# Altium project PCB_Project.PrjPcb
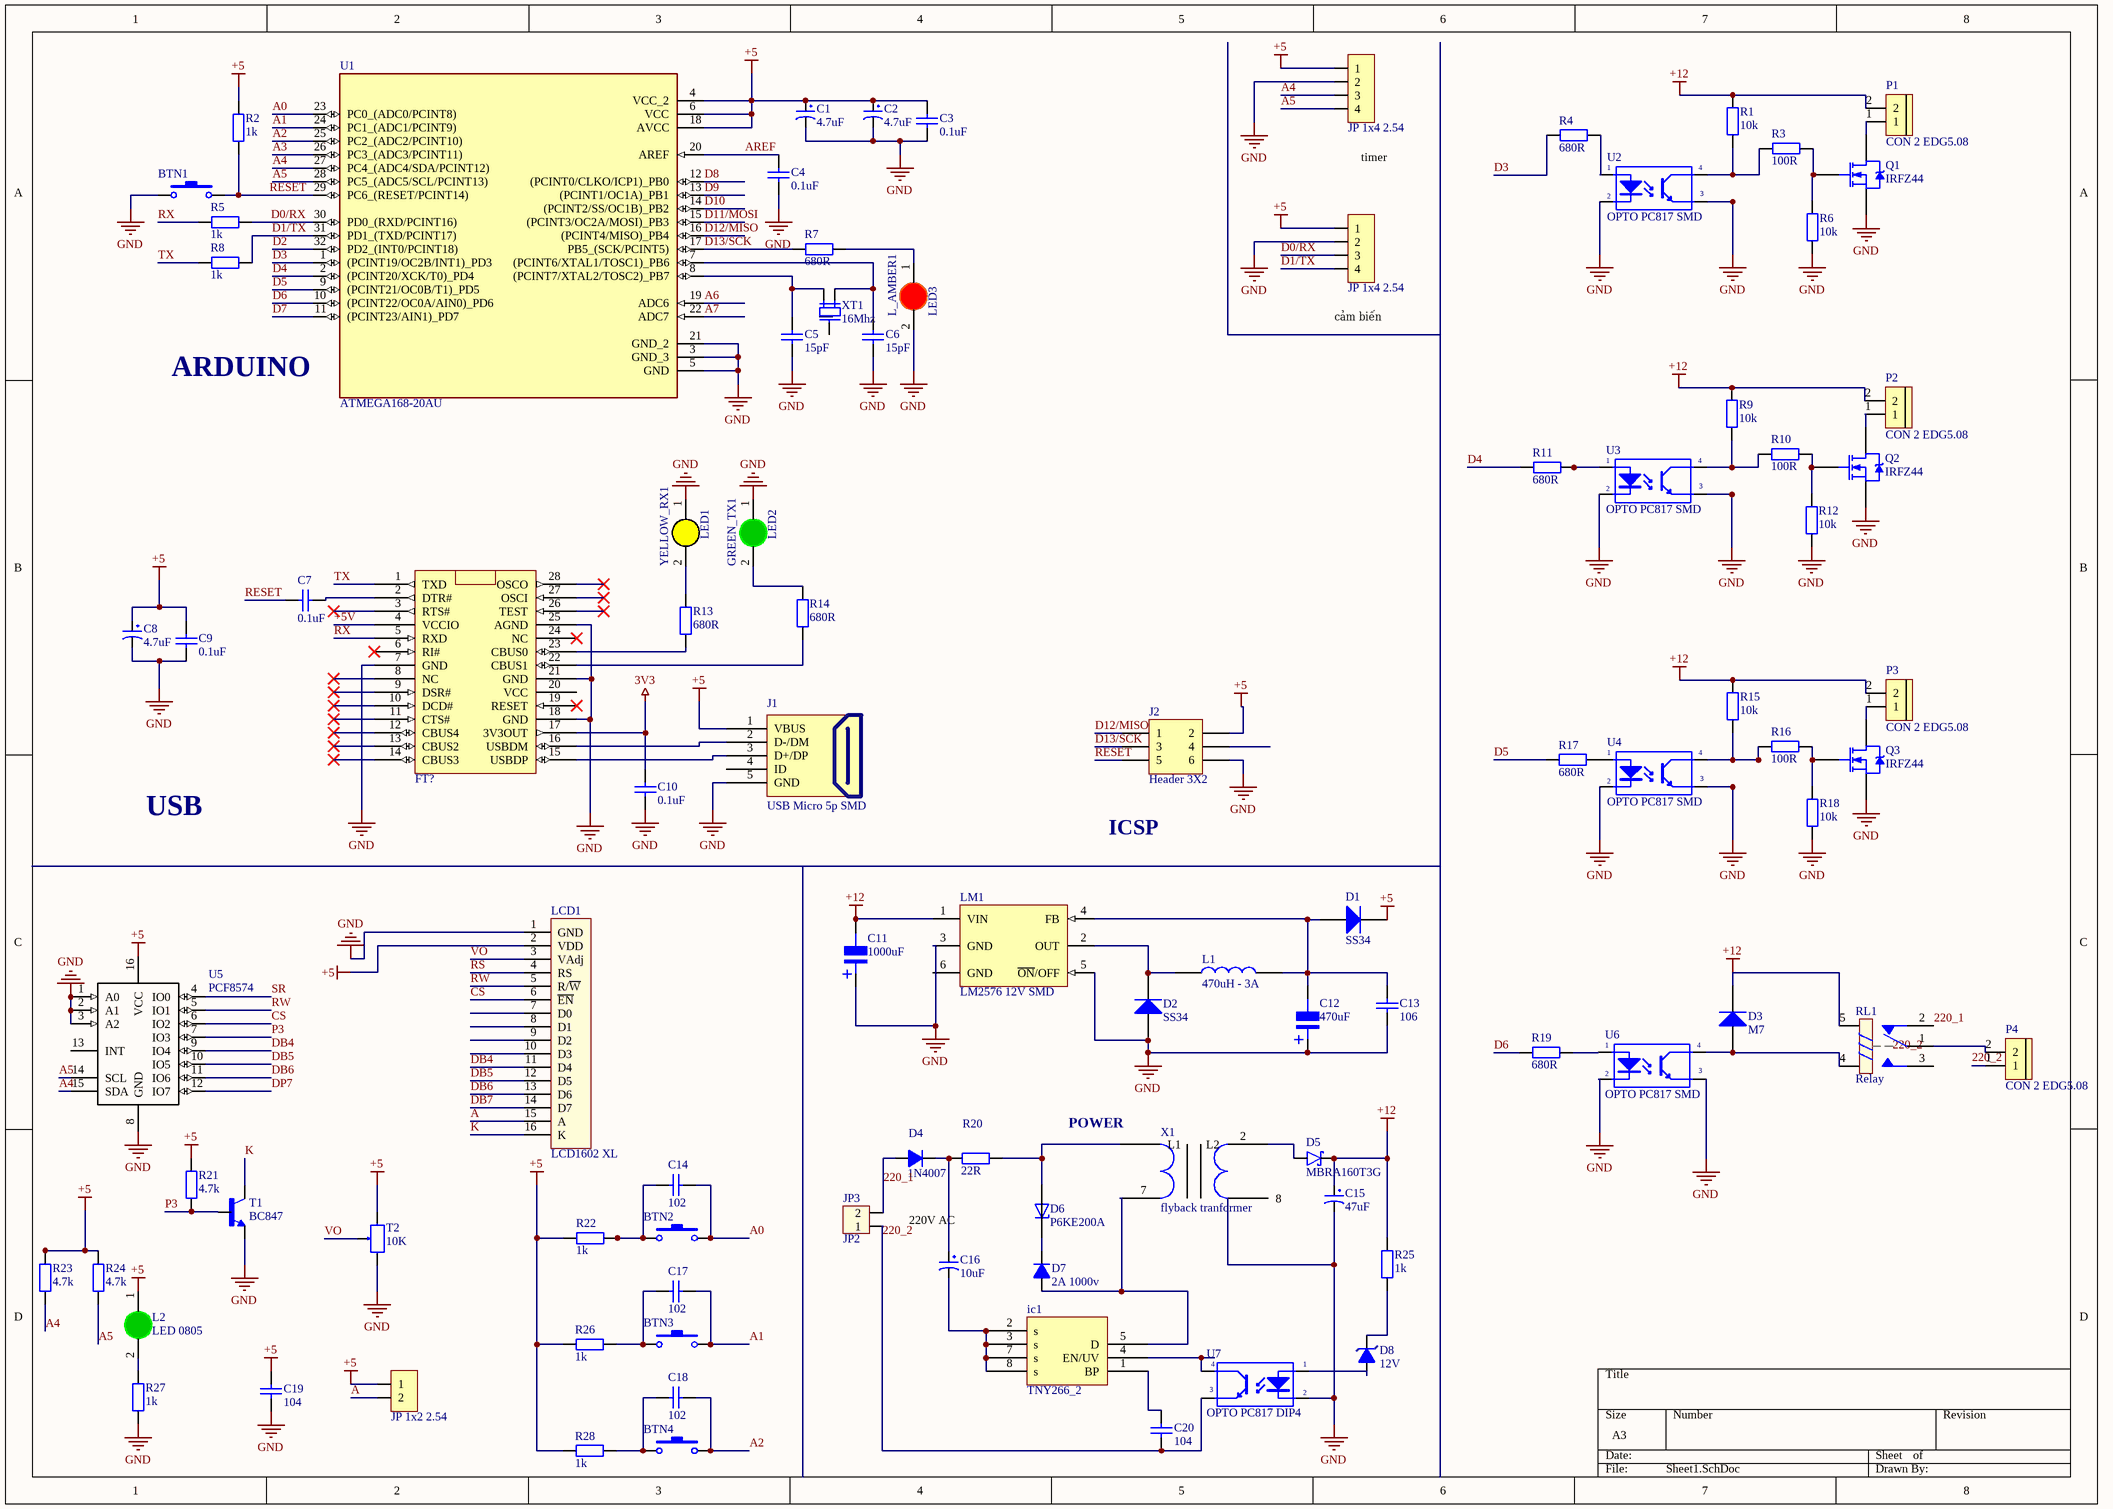
[diagram p0: Sheet1.SchDoc]
1 sheet, 94 parts. Net scope: global (net labels, ports and power ports of the same name join across sheets).
Board file: PCB1.PcbDoc

## Sheet Sheet1.SchDoc
size A3; SheetNumber: 1; SheetTotal: 1

### Parts
BTN1  Nut Nhan 2 Chan SMD 3x6x2.5  [Nut Nhan 2 Chan SMD 3x6x2.5]  (value not drawn)
BTN2  Nut Nhan 2 Chan SMD 3x6x2.5  [Nut Nhan 2 Chan SMD 3x6x2.5]  (value not drawn)
BTN3  Nut Nhan 2 Chan SMD 3x6x2.5  [Nut Nhan 2 Chan SMD 3x6x2.5]  (value not drawn)
BTN4  Nut Nhan 2 Chan SMD 3x6x2.5  [Nut Nhan 2 Chan SMD 3x6x2.5]  (value not drawn)
C1  4.7uF  [tu tantalum smd3216]
C2  4.7uF  [tu tantalum smd3216]
C3  0.1uF  [tu 0805]
C4  0.1uF  [tu 0805]
C5  15pF  [tu 0805]
C6  15pF  [tu 0805]
C7  0.1uF  [tu 0805]
C8  4.7uF  [tu tantalum smd3216]
C9  0.1uF  [tu 0805]
C10  0.1uF  [tu 0805]
C11  1000uF  [tu nhom 10 (G)]
C12  470uF  [tu nhom 10 (G)]
C13  106  [tu gom]
C14  102  [tu 0805]
C15  47uF  [tu hoa 5mm]
C16  10uF  [tu hoa 13mm]
C17  102  [tu 0805]
C18  102  [tu 0805]
C19  104  [tu 0805]
C20  104  [tu gom]
D1  SS34  [DIODE SMA]
D2  SS34  [DIODE SMA]
D3  M7  [DIODE SMA]
D4  1N4007  [D1A]
D5  MBRA160T3G  [DIOM5226X220N]
D6  P6KE200A  [DIOAD1276W78L760D360]
D7  2A 1000v  [DIODE 2A DUNG]
D8  12V  [DIODE ZENNER SMD SOD80]
FT?  FT232RL  [SSOP28-0.65-10.2X5.2MM]  (value not drawn)
GREEN_TX1  LED2  [LED-0805-Green]
ic1  TNY266_2  [DIP762W46P254L957H406Q7]
J1  USB Micro 5p SMD  [USB Mini 5p SMD]
J2  Header 3X2  [HDR2X3]
JP1  JP 1x4 2.54  [JP 1x4 CT]
JP2  JP 1x4 2.54  [JP 1x4 CT]
JP3  JP2  [CON2]
JP4  JP 1x2 2.54  [JP 1x2 DT]
L1  470uH - 3A  [CUON CAM 100uH3A]
L2  LED 0805  [LED-0805-Green]
L_AMBER1  LED3  [LED-0805-Red]
LCD1  LCD1602 XL  [LCD1602 with Jump]
LM1  LM2576 12V SMD  [TO263-5]
P1  CON 2 EDG5.08  [CON 2 2EDG5.08]
P2  CON 2 EDG5.08  [CON 2 2EDG5.08]
P3  CON 2 EDG5.08  [CON 2 2EDG5.08]
P4  CON 2 EDG5.08  [CON 2 2EDG5.08]
Q1  IRFZ44  [TO220]
Q2  IRFZ44  [TO220]
Q3  IRFZ44  [TO220]
R1  10k  [tro smd 0603]
R2  1k  [tro smd 0603]
R3  100R  [tro smd 0805]
R4  680R  [tro smd 0603]
R5  1k  [tro smd 0603]
R6  10k  [tro smd 0603]
R7  680R  [tro smd 0603]
R8  1k  [tro smd 0603]
R9  10k  [tro smd 0603]
R10  100R  [tro smd 0805]
R11  680R  [tro smd 0603]
R12  10k  [tro smd 0603]
R13  680R  [tro smd 0603]
R14  680R  [tro smd 0603]
R15  10k  [tro smd 0603]
R16  100R  [tro smd 0805]
R17  680R  [tro smd 0603]
R18  10k  [tro smd 0603]
R19  680R  [tro smd 0603]
R20  22R  [tro vach 2w]
R21  4.7k  [tro smd 0603]
R22  1k  [tro smd 0603]
R23  4.7k  [tro smd 0603]
R24  4.7k  [tro smd 0603]
R25  1k  [tro smd 1206]
R26  1k  [tro smd 0603]
R27  1k  [tro smd 0603]
R28  1k  [tro smd 0603]
RL1  Relay  [Relay 5 Chan SRD]
T1  BC847  [SOT23]
T2  10K  [Bien Tro Vi Chinh Dung]
U1  ATMEGA168-20AU  [ATMEGA168]
U2  OPTO PC817 SMD  [SOP4]
U3  OPTO PC817 SMD  [SOP4]
U4  OPTO PC817 SMD  [SOP4]
U5  PCF8574  [DIP16]
U6  OPTO PC817 SMD  [SOP4]
U7  OPTO PC817 DIP4  [DIP4]
X1  flyback tranformer  [flyback transformer]
XT1  16Mhz  [Thach Anh 3 Chan SMD]
YELLOW_RX1  LED1  [LED-0805-Yellow]

### Nets
3V3: C10.1 FT?.17(3V3OUT)
+5: C1.1 C2.1 C3.2 C8.1 C9.2 C19.2 D1.2(K) J1.1(VBUS) J2.2 JP1.1 JP2.1 JP4.1 L2.1(A) LCD1.2(VDD) R2.2 R22.1 R23.1 R24.1 R26.1 R28.1 T2.3 U1.4(VCC_2) U1.6(VCC) U1.18(AVCC) U5.16(VCC)
+12: C11.2 C15.1 D3.2(K) D5.C LM1.1(VIN) P1.2 P2.2 P3.2 R1.1 R9.1 R15.1 R25.1 RL1.5
GND: BTN1.1 C1.2 C2.2 C3.1 C4.2 C5.2 C6.2 C8.2 C9.1 C10.2 C11.1 C12.1 C13.2 C15.2 C19.1 D2.1(A) FT?.7(GND) FT?.18(GND) FT?.21(GND) FT?.25(AGND) GREEN_TX1.1(A) J1.5(GND) J2.6 JP1.2 JP2.2 L_AMBER1.2(K) LCD1.1(GND) LM1.3(GND) LM1.5(~{ON}/OFF) Q1.3(S) Q2.3(S) Q3.3(S) R6.2 R12.2 R18.2 R27.2 T1.2(E) T2.1 U1.3(GND_3) U1.5(GND) U1.21(GND_2) U2.2(K) U2.3(E) U3.2(K) U3.3(E) U4.2(K) U4.3(E) U5.1(A0) U5.2(A1) U5.3(A2) U5.8(GND) U6.2(K) U6.3(E) U7.2(K) X1.8 YELLOW_RX1.1(A)
220_1: D4.1(A) JP3.2 RL1.2
220_2: C20.1 JP3.1 P4.1 U7.3(E)
+5V: FT?.4(VCCIO)
A: JP4.2 LCD1.15(A)
A0: BTN2.2 C14.1 U1.23(PC0_(ADC0/PCINT8))
A1: BTN3.2 C17.1 U1.24(PC1_(ADC1/PCINT9))
A2: BTN4.2 C18.1 U1.25(PC2_(ADC2/PCINT10))
A3: U1.26(PC3_(ADC3/PCINT11))
A4: JP1.3 R23.2 U1.27(PC4_(ADC4/SDA/PCINT12)) U5.15(SDA)
A5: JP1.4 R24.2 U1.28(PC5_(ADC5/SCL/PCINT13)) U5.14(SCL)
A6: U1.19(ADC6)
A7: U1.22(ADC7)
AREF: C4.1 U1.20(AREF)
CS: LCD1.6(~{EN}) U5.6(IO2)
D0/RX: JP2.3 R5.2 U1.30(PD0_(RXD/PCINT16))
D1/TX: JP2.4 R8.2 U1.31(PD1_(TXD/PCINT17))
D2: U1.32(PD2_(INT0/PCINT18))
D3: R4.1 U1.1((PCINT19/OC2B/INT1)_PD3)
D4: R11.1 U1.2((PCINT20/XCK/T0)_PD4)
D5: R17.1 U1.9((PCINT21/OC0B/T1)_PD5)
D6: R19.1 U1.10((PCINT22/OC0A/AIN0)_PD6)
D7: U1.11((PCINT23/AIN1)_PD7)
D8: U1.12((PCINT0/CLKO/ICP1)_PB0)
D9: U1.13((PCINT1/OC1A)_PB1)
D10: U1.14((PCINT2/SS/OC1B)_PB2)
D11/MOSI: U1.15((PCINT3/OC2A/MOSI)_PB3)
D12/MISO: J2.1 U1.16((PCINT4/MISO)_PB4)
D13/SCK: J2.3 R7.1 U1.17(PB5_(SCK/PCINT5))
DB4: LCD1.11(D4) U5.9(IO4)
DB5: LCD1.12(D5) U5.10(IO5)
DB6: LCD1.13(D6) U5.11(IO6)
DB7: LCD1.14(D7)
DP7: U5.12(IO7)
K: LCD1.16(K) T1.3(C)
P3: R21.2 T1.1(B) U5.7(IO3)
RESET: BTN1.2 C7.2 J2.5 R2.1 U1.29(PC6_(RESET/PCINT14))
RS: LCD1.4(RS)
RW: LCD1.5(R/~{W}) U5.5(IO1)
RX: FT?.5(RXD) R5.1
SR: U5.4(IO0)
TX: FT?.1(TXD) R8.1
VO: LCD1.3(VAdj) T2.2
NetBTN2_1: BTN2.1 C14.2 R22.2
NetBTN3_1: BTN3.1 C17.2 R26.2
NetBTN4_1: BTN4.1 C18.2 R28.2
NetC5_1: C5.1 U1.8((PCINT7/XTAL2/TOSC2)_PB7) XT1.3
NetC6_1: C6.1 U1.7((PCINT6/XTAL1/TOSC1)_PB6) XT1.1
NetC7_1: C7.1 FT?.2(DTR#)
NetC12_2: C12.2 C13.1 D1.1(A) L1.2 LM1.4(FB)
NetC16_1: C16.1 D4.2(K) R20.1
NetC16_2: C16.2 ic1.2(s) ic1.3(s) ic1.7(s) ic1.8(s)
NetC20_2: C20.2 ic1.1(BP)
NetD2_2: D2.2(K) L1.1 LM1.2(OUT)
NetD3_1: D3.1(A) RL1.4 U6.4(C)
NetD5_A: D5.A X1.2(L2)
NetD6_A: D6.A R20.2 X1.1(L1)
NetD6_C: D6.C D7.2(K)
NetD7_1: D7.1(A) ic1.5(D) X1.7
NetD8_1: D8.1(A) U7.1(A)
NetD8_2: D8.2(K) R25.2
NetFT?_15: FT?.15(USBDP) J1.3(D+/DP)
NetFT?_16: FT?.16(USBDM) J1.2(D-/DM)
NetFT?_22: FT?.22(CBUS1) R14.1
NetFT?_23: FT?.23(CBUS0) R13.1
NetGREEN_TX1_2: GREEN_TX1.2(K) R14.2
Netic1_4: ic1.4(EN/UV) U7.4(C)
NetL2_2: L2.2(K) R27.1
NetL_AMBER1_1: L_AMBER1.1(A) R7.2
NetP1_1: P1.1 Q1.2(D)
NetP2_1: P2.1 Q2.2(D)
NetP3_1: P3.1 Q3.2(D)
NetP4_2: P4.2 RL1.1
NetQ1_1: Q1.1(G) R3.2 R6.1
NetQ2_1: Q2.1(G) R10.2 R12.1
NetQ3_1: Q3.1(G) R16.2 R18.1
NetR1_2: R1.2 R3.1 U2.4(C)
NetR4_2: R4.2 U2.1(A)
NetR9_2: R9.2 R10.1 U3.4(C)
NetR11_2: R11.2 U3.1(A)
NetR13_2: R13.2 YELLOW_RX1.2(K)
NetR15_2: R15.2 R16.1 U4.4(C)
NetR17_2: R17.2 U4.1(A)
NetR19_2: R19.2 U6.1(A)

Not connected (* = marked no-connect by the designer): FT? 3(RTS#)* 6(RI#)* 8(NC)* 9(DSR#)* 10(DCD#)* 11(CTS#)* 12(CBUS4)* 13(CBUS2)* 14(CBUS3)* 19(RESET)* 20(VCC) 24(NC)* 26(TEST)* 27(OSCI)* 28(OSCO)*; J1 4(ID); J2 4; LCD1 7(D0) 8(D1) 9(D2) 10(D3); LM1 6(GND); R21 1; RL1 3; U5 13(INT); XT1 2

### Notes on the sheet
- TIMER
- timer
- ARDUINO
- Text
- (near JP2) cảm biến
- USB
- ICSP
- POWER
- 220V AC
- Labels drawn without touching a wire or pin: 220_2, +5
- (in symbol Tu Nhom 470uF 35V) +
- (in symbol Tu Nhom 1000uF 10V) +

### Library data of the parts
BTN1-BTN4 = Nut Nhan 2 Chan SMD 3x6x2.5: Ma_Hang: MH001036; Ten: Nút Nhấn 2 Chân 3x6x2.5MM SMD
C1 C2 C8 = Tu tantalum 4.7uF 16V SMD3216: Dán; Don_Vi: Con; So_Chan: 2; Ten_Linh_Kien: Tụ tantalum 475C-4.7uF 16V SMD3216; Ma_Hang: MH008686; Chung_Loai: Dán; Kieu_Chan: *
C3 C4 C7 C9 C10 = Tu 0805 10pF 50V 10%: Dán; Don_Vi: Con; So_Chan: 2; Ten_Linh_Kien: Tụ 0805 10P 10% 50V; Ma_Hang: MH004554; Chung_Loai: Dán; Kieu_Chan: *
C5 C6 = Tu 0805 15pF 50V 10%: Dán; Don_Vi: Con; So_Chan: 2; Ten_Linh_Kien: Tụ 0805 15P 10% 50V; Ma_Hang: MH004556; Chung_Loai: Dán; Kieu_Chan: *
C11 = Tu Nhom 1000uF 10V: Dán; So_Chan: 2; Don_Vi: Con; Ten_Linh_Kien: Tụ Nhôm 1000uF 10V; Ma_Hang: MH007515; Chung_Loai: Dán; Kieu_Chan: *
C12 = Tu Nhom 470uF 35V: Dán; Don_Vi: Con; So_Chan: 2; Ten_Linh_Kien: Tụ Nhôm 470uF 35V 10x10.5MM; Ma_Hang: MH004418; Chung_Loai: Dán; Kieu_Chan: *
C13 C20 = Tu gom 104 50V: Cắm; So_Chan: 2; Ten_Linh_Kien: Tụ gốm 104 100nF 50V; Don_Vi: Con; Ma_Hang: MH004761; Chung_Loai: Cắm; Kieu_Chan: *
C14 C17 C18 = Tu 0805 102 50V 10%: Dán; Don_Vi: Con; So_Chan: 2; Ten_Linh_Kien: Tụ 0805 102-1nF 10% 50V; Ma_Hang: MH004549; Chung_Loai: Dán; Kieu_Chan: *
C15 = Tu Hoa 47uF 25V 5x8: Cắm; Don_Vi: Con; So_Chan: 2; Ten_Linh_Kien: Tụ Hóa 47uF 25V; Ma_Hang: MH006860; Chung_Loai: Cắm; Kieu_Chan: *
C16 = Tu Hoa 10uF 450V 13x20: Cắm; Don_Vi: Con; So_Chan: 2; Ten_Linh_Kien: Tụ Hóa 10uF 450V 13x20MM; Ma_Hang: MH003950; Chung_Loai: Cắm; Kieu_Chan: *
C19 = Tu 0805 104 50V 10%: Dán; Don_Vi: Con; So_Chan: 2; Ten_Linh_Kien: Tụ 0805 104-100nF 10% 50V; Ma_Hang: MH004551; Chung_Loai: Dán; Kieu_Chan: *
D1 D2 = Diode SS34 ( 1N5822 ): Dán; Don_Vi: Con; Ma_Hang: MH002104; Ten_Linh_Kien: Diode SS34 3A 40V SMA ( 1N5822 SS34A); Kieu_Chan: *; Chung_Loai: Dán
D3 = Diode M7 ( 4007 ): Dán; Don_Vi: Con; Ten_Linh_Kien: Diode M7 1N4007 SMD 1A 1000V; Ma_Hang: MH000944; Chung_Loai: Dán; Ghi_Chu: *
D4 = D1A: Diode 1A; Value: 1N4007
D5 = MBRA160T3G: Diode Schottky 60V 1A Surface Mount SMA; MF: ON Semiconductor; Availability: Unavailable; SnapEDA_Link: https://www.snapeda.com/parts/MBRA160T3G/ON%20Semiconductor/view-part/313183/?ref=snap; Price: None; Package: DO-214 ON Semiconductor; MP: MBRA160T3G; Value: *
D6 = P6KE200A: 600W, 200V, 5%, Unidirectional, TVS; MF: Taiwan Semiconductor; Package: AXIAL-2 Taiwan Semiconductor; Value: *; MP: P6KE200A; Availability: In Stock; Purchase-URL: https://pricing.snapeda.com/search/part/P6KE200A/?ref=eda; Price: None
D7 = Diode FR207: Cắm; Ten_Linh_Kien: Diode FR207 2A 1000V ( DIP); Don_Vi: Con; Ma_Hang: MH005704; Ghi Chu: *; Kieu_Chan: *; Chung_Loai: Cắm
D8 = Diode Zener 12V: Dán; Ma_Hang: MH000945; Don_Vi: Con; Ten_Linh_Kien: Diode Zener 1/2W 12V SMD1206 ZMM12; Kieu_Chan: *; Ghi_Chu: *; Chung_Loai: Dán
GREEN_TX1 L2 = LED 0805 Xanh La: Dán; Don_Vi: Con; Ma_Hang: MH002326; Ten_Linh_Kien: LED 0805 Màu Xanh Lá (Green); Ghi_Chu: *; Kieu_Chan: *; Chung_Loai: Dán
J1 = USB Micro 5p SMD: USB Type B; Ten: MicroUSB MK5P SMD; Ma_Hang: MH001020
J2 = Header 3X2: Header, 3-Pin, Dual row; LatestRevisionDate: 17-Jul-2002; LatestRevisionNote: Re-released for DXP Platform.; Publisher: Altium Limited
JP1 JP2 = JP 1x4 2.54 Cai Thang: Cắm; Ten_Linh_Kien: Jump Đơn Cái 2.54MM 1x20P Thẳng; Don_Vi: Con; Ma_Hang: MH004006; Ghi_Chu: *; Kieu_Chan: *; Chung_Loai: Cắm
JP3 = Con2: Connector 2; Value: Connector 2
JP4 = JP 1x2 2.54 Duc Thang: Cắm; Ten_Linh_Kien: Jump Đơn Đực 2.54MM 1x40P Thẳng 11MM; Don_Vi: Con; Ma_Hang: MH000903; Ghi_Chu: *; Kieu_Chan: *; Chung_Loai: Cắm
L1 = CUON CAM 470uH DIP: Cắm; Don_Vi: Con; Ma_Hang: MH002232; Ten_Linh_Kien: Cuộn Cảm 470uH 3A 8x10MM; Ghi_Chu: *; Kieu_Chan: *; Chung_Loai: Cắm
L_AMBER1 = LED 0805 Do: Dán; Don_Vi: Con; Ma_Hang: MH000897; Ten_Linh_Kien: LED 0805 Màu Đỏ (Red); Ghi_Chu: *; Kieu_Chan: *; Chung_Loai: Dán
LCD1 = LCD1602 XL: LCD 1602 Xanh Lá; Ten: Màn hình LCD 1602 Xanh Lá; Ma_Hang: 67HZ; NCC: NSHOP; CHIP: HD44780
LM1 = LM2576 12V SMD: Dán; Don_Vi: Con; Ma_Hang: MH002369; Ten_Linh_Kien: LM2576HVS-12V BUCK 12V 3A TO263-5; Ghi_Chu: *; Kieu_Chan: *; Chung_Loai: Dán
P1-P4 = CON 2 EDG5.08: Cắm; Ten_Linh_Kien: CON 2 2EDG5.08-2P 5.08MM ( Xanh Cong); Ma_Hang: MH000759; Ghi_Chu: *; Don_Vi: Con; Kieu_Chan: *; Chung_Loai: Cắm
Q1-Q3 = IRFZ44 DIP: N-Channel Power MOSFET
R1 R6 R9 R12 R15 R18 = Tro 0603 1% 10k: Dán; Don_Vi: Con; So_Chan: 2; Ten_Linh_Kien: Trở 0603 1% 10k; Ma_Hang: MH006333; Chung_Loai: Dán; Kieu_Chan: *
R2 R5 R8 R27 = Tro 0603 1% 1k: Dán; So_Chan: 2; Don_Vi: Con; Ten_Linh_Kien: Trở 0603 1% 1k; Ma_Hang: MH006334; Chung_Loai: Dán; Kieu_Chan: *
R3 R10 R16 = Tro 0805 5% 100R: Dán; Don_Vi: Con; So_Chan: 2; Ten_Linh_Kien: Trở 0805 5% 100R; Ma_Hang: MH005251; Chung_Loai: Dán; Kieu_Chan: *
R4 R7 R11 R13 R14 R17 R19 = Tro 0603 1% 680R: Dán; Don_Vi: Con; So_Chan: 2; Ten_Linh_Kien: Trở 0603 1% 680R; Ma_Hang: MH006336; Chung_Loai: Dán; Kieu_Chan: *
R20 = Tro Vach 2W 5% 22R: Cắm; Don_Vi: Con; So_Chan: 2; Ten_Linh_Kien: Trở 5% 2w 22R; Ma_Hang: MH006369; Chung_Loai: Cắm; Kieu_Chan: *
R21 R23 R24 = Tro 0603 5% 4.7k: Dán; Don_Vi: Con; So_Chan: 2; Ten_Linh_Kien: Trở 0603 5% 4.7k; Ma_Hang: MH006327; Chung_Loai: Dán; Kieu_Chan: *
R22 R26 R28 = Tro 0603 5% 1k: Dán; Don_Vi: Con; So_Chan: 2; Ten_Linh_Kien: Trở 0603 5% 1k; Ma_Hang: MH006319; Chung_Loai: Dán; Kieu_Chan: *
R25 = Tro 1206 1% 1k: Dán; Don_Vi: Con; So_Chan: 2; Ten_Linh_Kien: Trở 1206 1% 1k; Ma_Hang: MH005880; Chung_Loai: Dán; Kieu_Chan: *
RL1 = Relay 5 Chan SRD: Relay 5 Chan; Ma_Hang: MH009374; Ten: Relay 5V10A SRD-05VDC-SL-C Chính Hãng
T1 = BC847: Bipolar _BJT_ Transistor NPN 45V 100mA 100MHz 150mW Surface Mount SOT-523; MF: Rectron; Package: SOT-523 Rectron; Value: *; Price: None; MP: BC847; SnapEDA_Link: https://www.snapeda.com/parts/BC847/Rectron/view-part/4637030/?ref=snap; Availability: Unavailable
T2 = Bien Tro Tinh Chinh 10K Dung: Cắm; Ma_Hang: MH003232; Ten_Linh_Kien: Biến Trở VR 103-10K 3296W; Don_Vi: Con; Kieu_Chan: *; Chung_Loai: Cắm; Ghi_Chu: *
U1 = ATMEGA168-20AU: AVR AVRÂ® ATmega Microcontroller IC 8-Bit 20MHz 16KB _8K x 16_ FLASH 32-TQFP _7x7_; MF: Microchip; MP: ATMEGA168-20AU; Availability: Unavailable; Package: TQFP-32 Microchip; Price: None; SnapEDA_Link: https://www.snapeda.com/parts/ATMEGA168-20AU/Microchip/view-part/776709/?ref=snap; Value: *
U2-U4 U6 = OPTO PC817 SMD: Single Opto; Value: PC817
U5 = PCF8574: I2C PORT EXPANDER; Manufacturer Part Number: PCF8574T/3,512; Manufacturer: NXP Semiconductors; Includes: POR; Interface: I²C; Interrupt Output: Yes; Number of I /O: 8; Voltage - Supply: 2.5 V ~ 6 V; Frequency - Clock: 100KHz; Supplier 1: Digi-Key; Supplier Part Number 1: 568-1076-5-ND; Package / Case: 16-SOIC (7.5mm Width); Category: Integrated Circuits (ICs); Supplier Part Number: 568-1076-5-ND; Operating Temperature: -40°C ~ 85°C; Packaging: Tube; RoHS: RoHS Compliant; Supplier: Digi-Key
U7 = OPTO PC817 DIP4: Single Opto; Value: PC817
XT1 = Thach anh 3 Chan SMD: Crystal For all Crystal 2pin.; Value: 4Mhz
YELLOW_RX1 = LED 0805 Vang: Dán; Don_Vi: Con; Ma_Hang: MH002329; Ten_Linh_Kien: LED 0805 Màu Vàng ( Yellow); Ghi_Chu: *; Kieu_Chan: *; Chung_Loai: Dán